# EasyEDA schematic SCH_前置放大电路.json
TITLE: 前置放大电路; REV: 1.0; Date: 2022-10-06; Sheet: 1/1; Drawn By: Banzhuan3721; Company: 垃圾桶
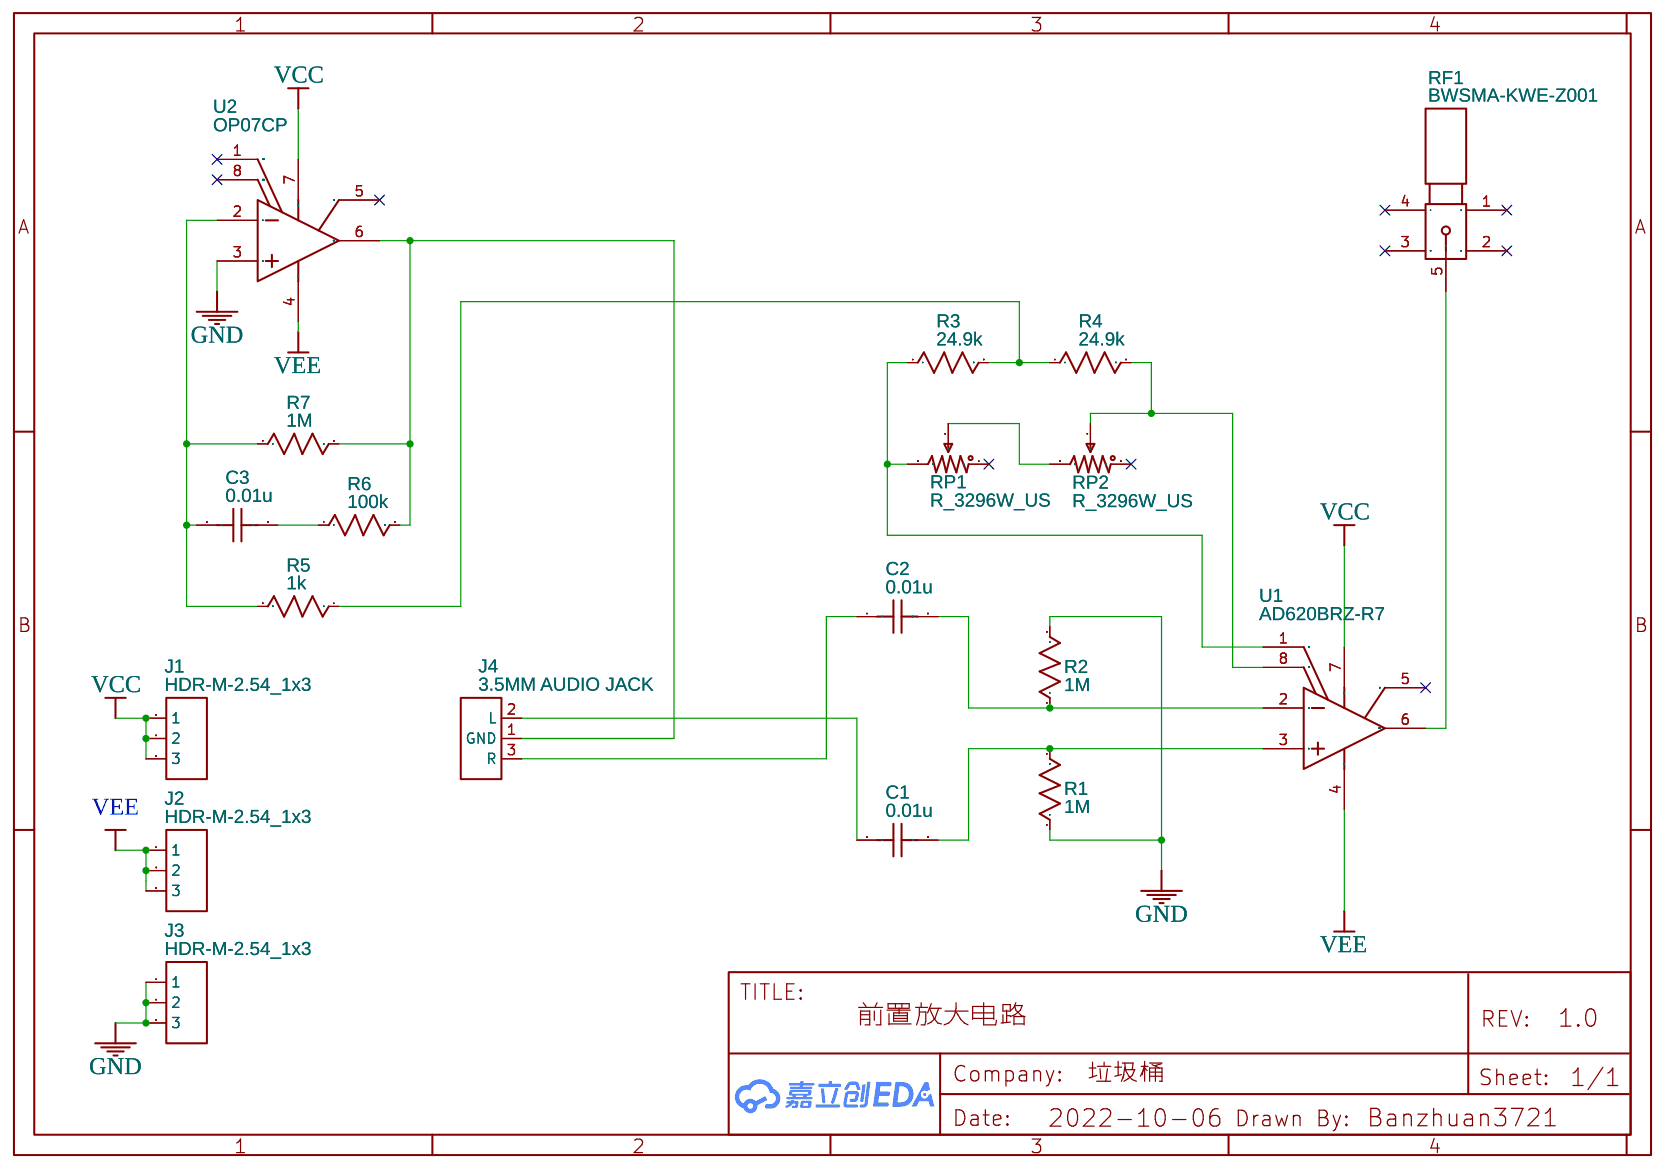
[diagram p0: schematic sheet]

## Parts
C1  0.01u  [RAD-0.2]
C2  0.01u  [RAD-0.2]
C3  0.01u  [RAD-0.2]
J1  HDR-M-2.54_1x3  [HDR-M-2.54_1X3]
J2  HDR-M-2.54_1x3  [HDR-M-2.54_1X3]
J3  HDR-M-2.54_1x3  [HDR-M-2.54_1X3]
J4  3.5MM AUDIO JACK  [3.5MM耳机接口]
R1  1M  [R_AXIAL-0.3]
R2  1M  [R_AXIAL-0.3]
R3  24.9k  [R_AXIAL-0.3]
R4  24.9k  [R_AXIAL-0.3]
R5  1k  [R_AXIAL-0.3]
R6  100k  [R_AXIAL-0.3]
R7  1M  [R_AXIAL-0.3]
RF1  BWSMA-KWE-Z001  [SMA-TH_BWSMA-KWE-Z001]
RP1  R_3296W_US  [RES-ADJ-TH_3296W]
RP2  R_3296W_US  [RES-ADJ-TH_3296W]
U1  AD620BRZ-R7  [DIP-8_L9.3-W6.4-P2.54-LS7.6-BL]
U2  OP07CP  [DIP-8_L9.6-W6.4-P2.54-LS7.6-BL-1]

## Library data of the parts
C1-C3 = C_RAD-0.2_US: Contributor: LCEDA_Lib
J1-J3 = HDR-M-2.54_1x3: Supplier Part: C180248; Supplier: LCSC; Contributor: LCEDA_Lib
J4 = 3.5MM AUDIO JACK: Supplier: LCSC; Manufacturer: BOOMELE; Manufacturer Part: PJ-325M/3.5MM; image: //image.lceda.cn/szlcsc/C26230.jpg; Supplier Part: C26230; Contributor: LiChuang0000
R1-R7 = R_AXIAL-0.3_US: Contributor: LCEDA_Lib
RF1 = BWSMA-KWE-Z001: Supplier: LCSC; Supplier Part: C496551; Manufacturer: BAT WIRELESS; Contributor: LCSC; JLCPCB Part Class: Extended Part
RP1 RP2 = R_3296W_US: Supplier: LCSC; Contributor: LCEDA_Lib; value(Ω): 10K
U1 = AD620BRZ-R7: Supplier: LCSC; Supplier Part: C392899; Manufacturer: Analog Devices; Contributor: LCSC; JLCPCB Part Class: Extended Part
U2 = OP07CP: Supplier: LCSC; Manufacturer: TI; Supplier Part: C5224; JLCPCB Part Class: Extended Part

## Nets
GND: J3.1 J3.2 J3.3 R1.1 R2.2 U2.3(IN+)
VCC: J1.1 J1.2 J1.3 U1.7(+VS) U2.7(VCC+)
VEE: J2.1 J2.2 J2.3 U1.4(-VS) U2.4(VCC-)
Net-(C1-1): C1.1 J4.2(L)
Net-(C1-2): C1.2 R1.2 U1.3(IN+)
Net-(C2-1): C2.1 J4.3(R)
Net-(C2-2): C2.2 R2.1 U1.2(IN-)
Net-(C3-1): C3.1 R5.2 R7.1 U2.2(IN-)
Net-(C3-2): C3.2 R6.1
Net-(J4-1): J4.1(GND) R6.2 R7.2 U2.6(OUT)
Net-(R3-1): R3.1 RP1.3 U1.1(RG)
Net-(R3-2): R3.2 R4.1 R5.1
Net-(R4-2): R4.2 RP2.2 U1.8(RG)
Net-(RF1-5): RF1.5 U1.6(OUTPUT)
Net-(RP1-2): RP1.2 RP2.3

Not connected (* = marked no-connect by the designer): RF1 1* 2* 3* 4*; RP1 1*; RP2 1*; U1 5(REF)*; U2 1(OFFSET_N1)* 5(NC)* 8(OFFSET_N2)*
